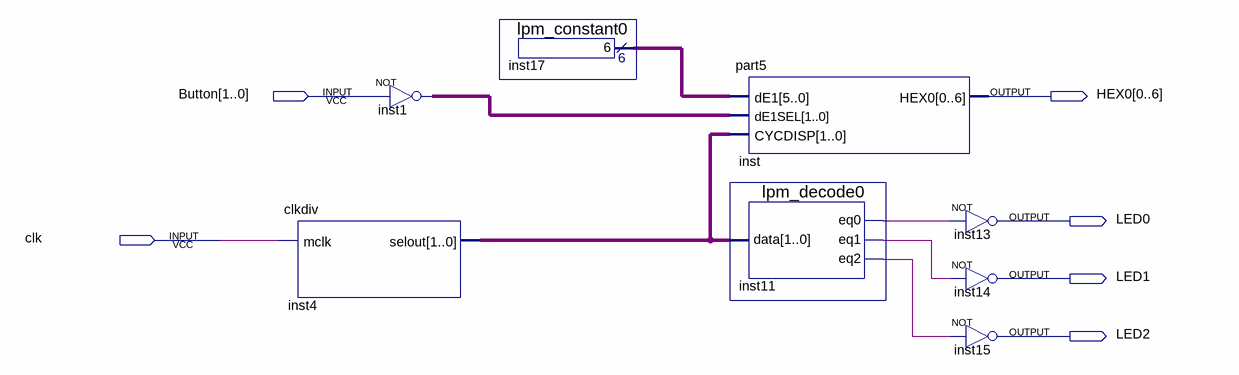
[diagram p0: schematic sheet]
// Quartus schematic part5top.bdf as structural Verilog: 8 symbols, 6 pins
module part5top (
  input  [1:0] Button,
  input  clk,
  output [0:6] HEX0,
  output LED0,
  output LED1,
  output LED2
);

  wire inst11_eq0, inst11_eq1, inst11_eq2;
  wire [1:0] inst1_out, inst4_selout;
  wire [5:0] inst17_result;

  clkdiv inst4 (.mclk(clk), .selout(inst4_selout));
  assign inst1_out = ~Button;  // NOT inst1, 2 bits wide
  lpm_constant0 inst17 (.result(inst17_result));
  part5 inst (.dE1(inst17_result), .dE1SEL(inst1_out), .CYCDISP(inst4_selout), .HEX0(HEX0));
  lpm_decode0 inst11 (.data(inst4_selout), .eq0(inst11_eq0), .eq1(inst11_eq1), .eq2(inst11_eq2));
  not inst13 (LED0, inst11_eq0);
  not inst14 (LED1, inst11_eq1);
  not inst15 (LED2, inst11_eq2);
endmodule
